# EAGLE design tx (EAGLE 7.2.0)
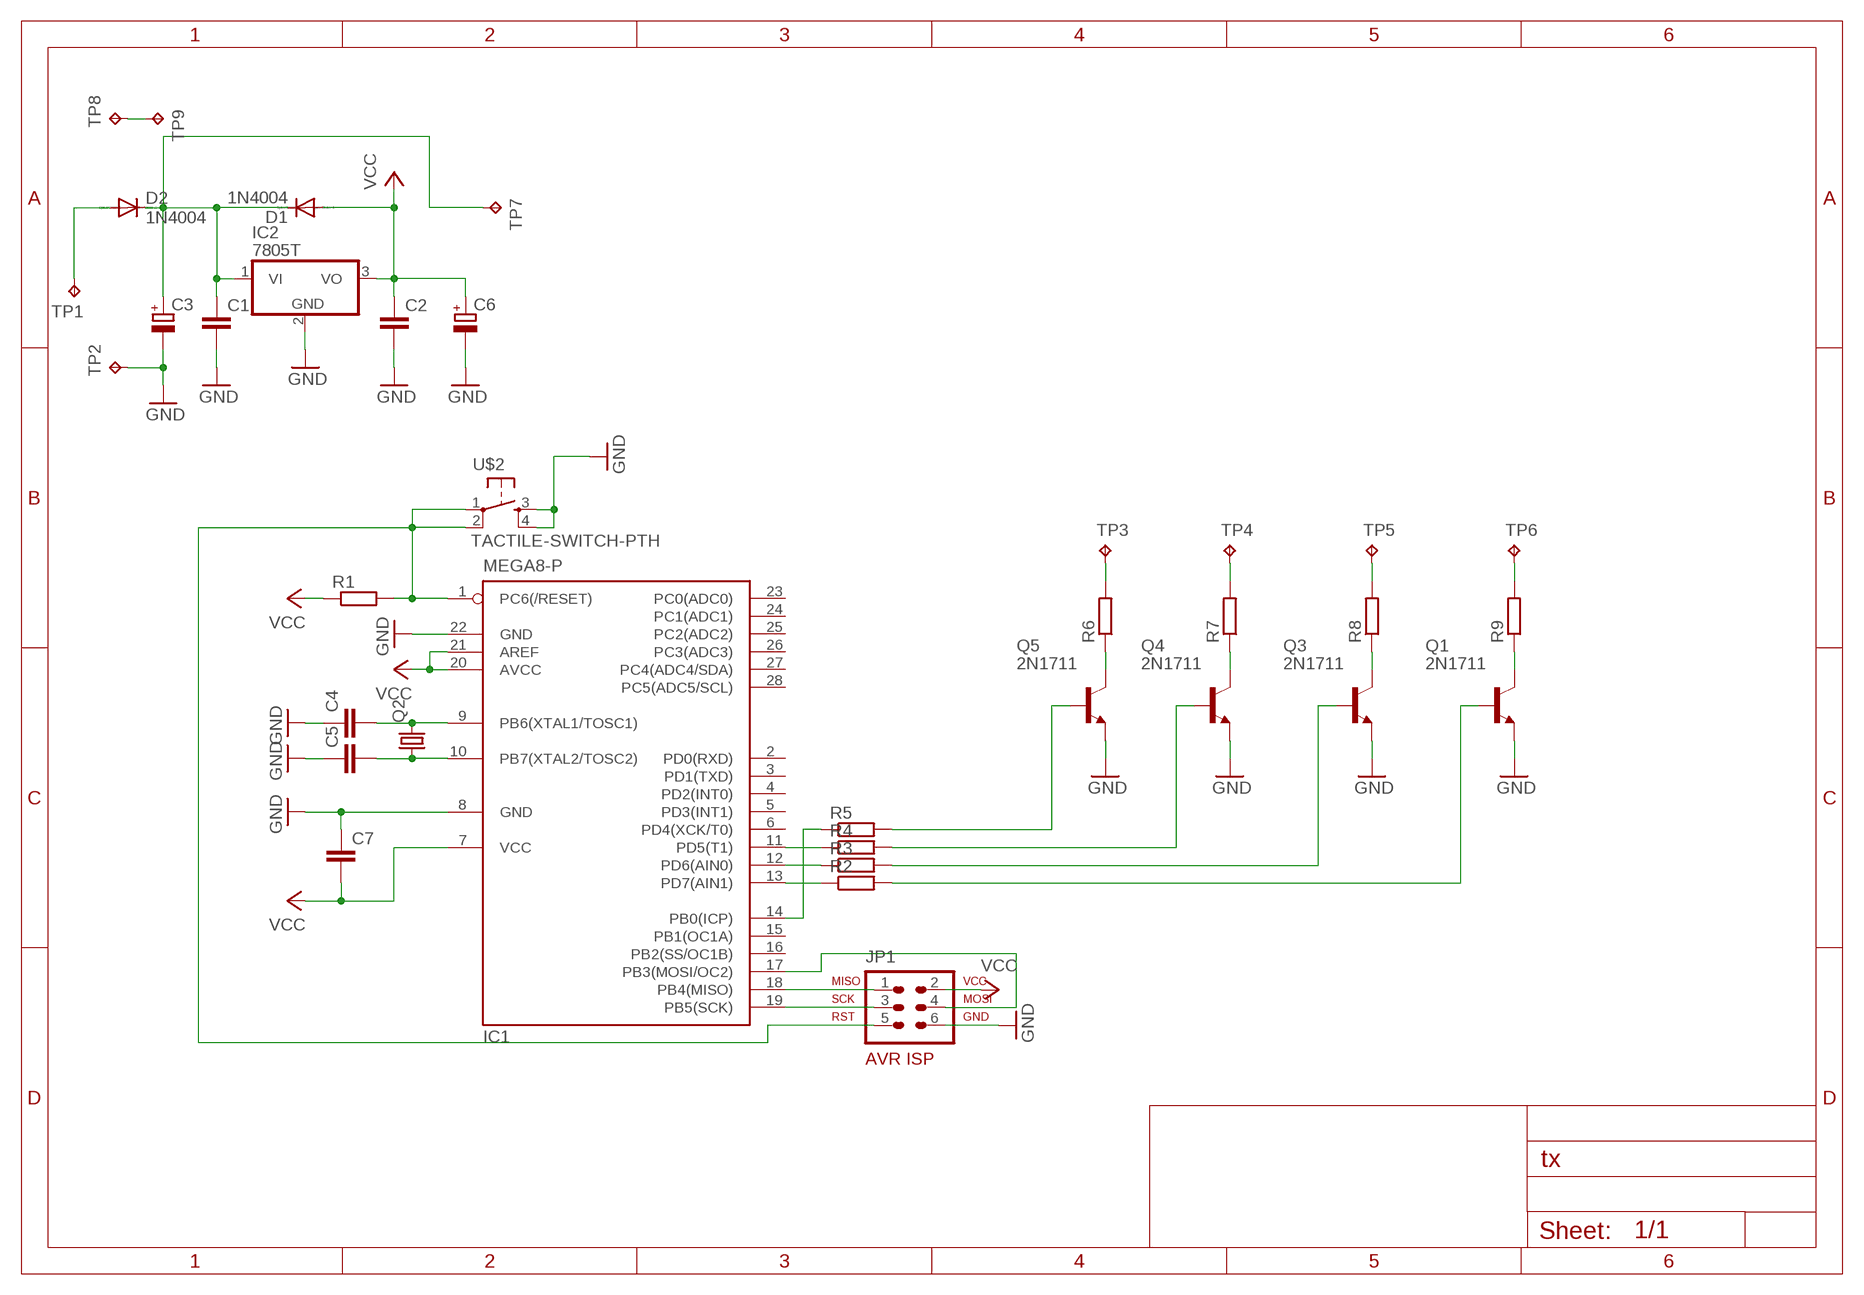
[diagram p0: schematic, sheet 1]

## Parts
C1  C-EU050-030X075  [C050-030X075]
C2  C-EU050-030X075  [C050-030X075]
C3  CPOL-EUE3.5-8  [E3,5-8]
C4  C-EU050-030X075  [C050-030X075]
C5  C-EU050-030X075  [C050-030X075]
C6  CPOL-EUE3.5-8  [E3,5-8]
C7  C-EU050-030X075  [C050-030X075]
D1  1N4004  [DO41-10]
D2  1N4004  [DO41-10]
IC1  MEGA8-P  [DIL28-3]
IC2  7805T  [TO220H]
JP1  AVR-ISP-6HORZ  [AVR-ISP-6R]
Q1  2N1711  [TO39]
Q2  CRYSTALHC49U70  [HC49U70]
Q3  2N1711  [TO39]
Q4  2N1711  [TO39]
Q5  2N1711  [TO39]
R1  R-EU_0204/7  [0204/7]
R2  R-EU_0204/7  [0204/7]
R3  R-EU_0204/7  [0204/7]
R4  R-EU_0204/7  [0204/7]
R5  R-EU_0204/7  [0204/7]
R6  R-EU_0204/7  [0204/7]
R7  R-EU_0204/7  [0204/7]
R8  R-EU_0204/7  [0204/7]
R9  R-EU_0204/7  [0204/7]
TP1  TPPAD1-13Y  [P1-13Y]
TP2  TPPAD1-13Y  [P1-13Y]
TP3  TPPAD1-13Y  [P1-13Y]
TP4  TPPAD1-13Y  [P1-13Y]
TP5  TPPAD1-13Y  [P1-13Y]
TP6  TPPAD1-13Y  [P1-13Y]
TP7  TPPAD1-13Y  [P1-13Y]
TP8  TPPAD1-13Y  [P1-13Y]
TP9  TPPAD1-13Y  [P1-13Y]
U$2  TACTILE-SWITCH-PTH  [TAC-SWITCH-PTH]

## Nets
GND: C1.2 C2.2 C3.- C4.1 C5.1 C6.- C7.1 IC1.8(GND) IC1.22(GND) IC2.2(GND) JP1.6 Q1.1(E) Q3.1(E) Q4.1(E) Q5.1(E) TP2.TP U$2.3 U$2.4
N$1: TP8.TP TP9.TP
N$2: C1.1 C3.+ D1.C D2.C IC2.1(VI) TP7.TP
N$3: IC1.1(PC6(/RESET)) JP1.5 R1.2 U$2.1 U$2.2
N$4: IC1.18(PB4(MISO)) JP1.1
N$5: IC1.19(PB5(SCK)) JP1.3
N$6: IC1.17(PB3(MOSI/OC2)) JP1.4
N$7: IC1.14(PB0(ICP)) R5.1
N$8: C4.2 IC1.9(PB6(XTAL1/TOSC1)) Q2.2
N$9: C5.2 IC1.10(PB7(XTAL2/TOSC2)) Q2.1
N$10: D2.A TP1.TP
N$11: IC1.11(PD5(T1)) R4.1
N$12: IC1.12(PD6(AIN0)) R3.1
N$13: IC1.13(PD7(AIN1)) R2.1
N$14: R6.2 TP3.TP
N$15: R7.2 TP4.TP
N$16: R8.2 TP5.TP
N$17: R9.2 TP6.TP
N$18: Q1.3(C) R9.1
N$19: Q3.3(C) R8.1
N$20: Q4.3(C) R7.1
N$21: Q5.3(C) R6.1
N$22: Q1.2(B) R2.2
N$23: Q3.2(B) R3.2
N$24: Q4.2(B) R4.2
N$25: Q5.2(B) R5.2
VCC: C2.1 C6.+ C7.2 D1.A IC1.7(VCC) IC1.20(AVCC) IC1.21(AREF) IC2.3(VO) JP1.2 R1.1
Unconnected: IC1.2(PD0(RXD)) IC1.3(PD1(TXD)) IC1.4(PD2(INT0)) IC1.5(PD3(INT1)) IC1.6(PD4(XCK/T0)) IC1.15(PB1(OC1A)) IC1.16(PB2(SS/OC1B)) IC1.23(PC0(ADC0)) IC1.24(PC1(ADC1)) IC1.25(PC2(ADC2)) IC1.26(PC3(ADC3)) IC1.27(PC4(ADC4/SDA)) IC1.28(PC5(ADC5/SCL))

## Library data of the parts
C1 C2 C4 C5 C7 = resistor:C-EU: CAPACITOR, European symbol
C3 C6 = resistor:CPOL-EU: POLARIZED CAPACITOR, European symbol
D1 D2 = diode:1N4004: DIODE general purpose rectifier, 1 A
IC1 = atmel:MEGA8-P: MICROCONTROLLER 8 Kbytes FLASH, 1 kbytes SRAM, 512 bytes EEPROM, USART, 4-channel 10 bit ADC, 2-channel 8 bit ADC Pin compatible with Atmega48, ATMega88, ATMega168 Source: avr.lbr; OC_FARNELL: unknown; OC_NEWARK: unknown
IC2 = linear:78*: Positive VOLTAGE REGULATOR Source: http://cache.national.com/ds/LM/LM78L05.pdf http://www.fairchildsemi.com/ds/LM/LM7805.pdf
JP1 = avr-7:AVR-ISP-6: AVR ISP-6 Serial Programming Header
Q1 Q3-Q5 = transistor-npn:2N1711: NPN Transistor
Q2 = crystal:CRYSTAL: CRYSTAL; OC_FARNELL: unknown; OC_NEWARK: unknown
R1-R9 = resistor:R-EU_: RESISTOR, European symbol
TP1-TP9 = testpad:TP: Test pad
U$2 = GeekAmmo:TACTILE-SWITCH: Tactile Switch 4 Pins, SPST NO

## Board
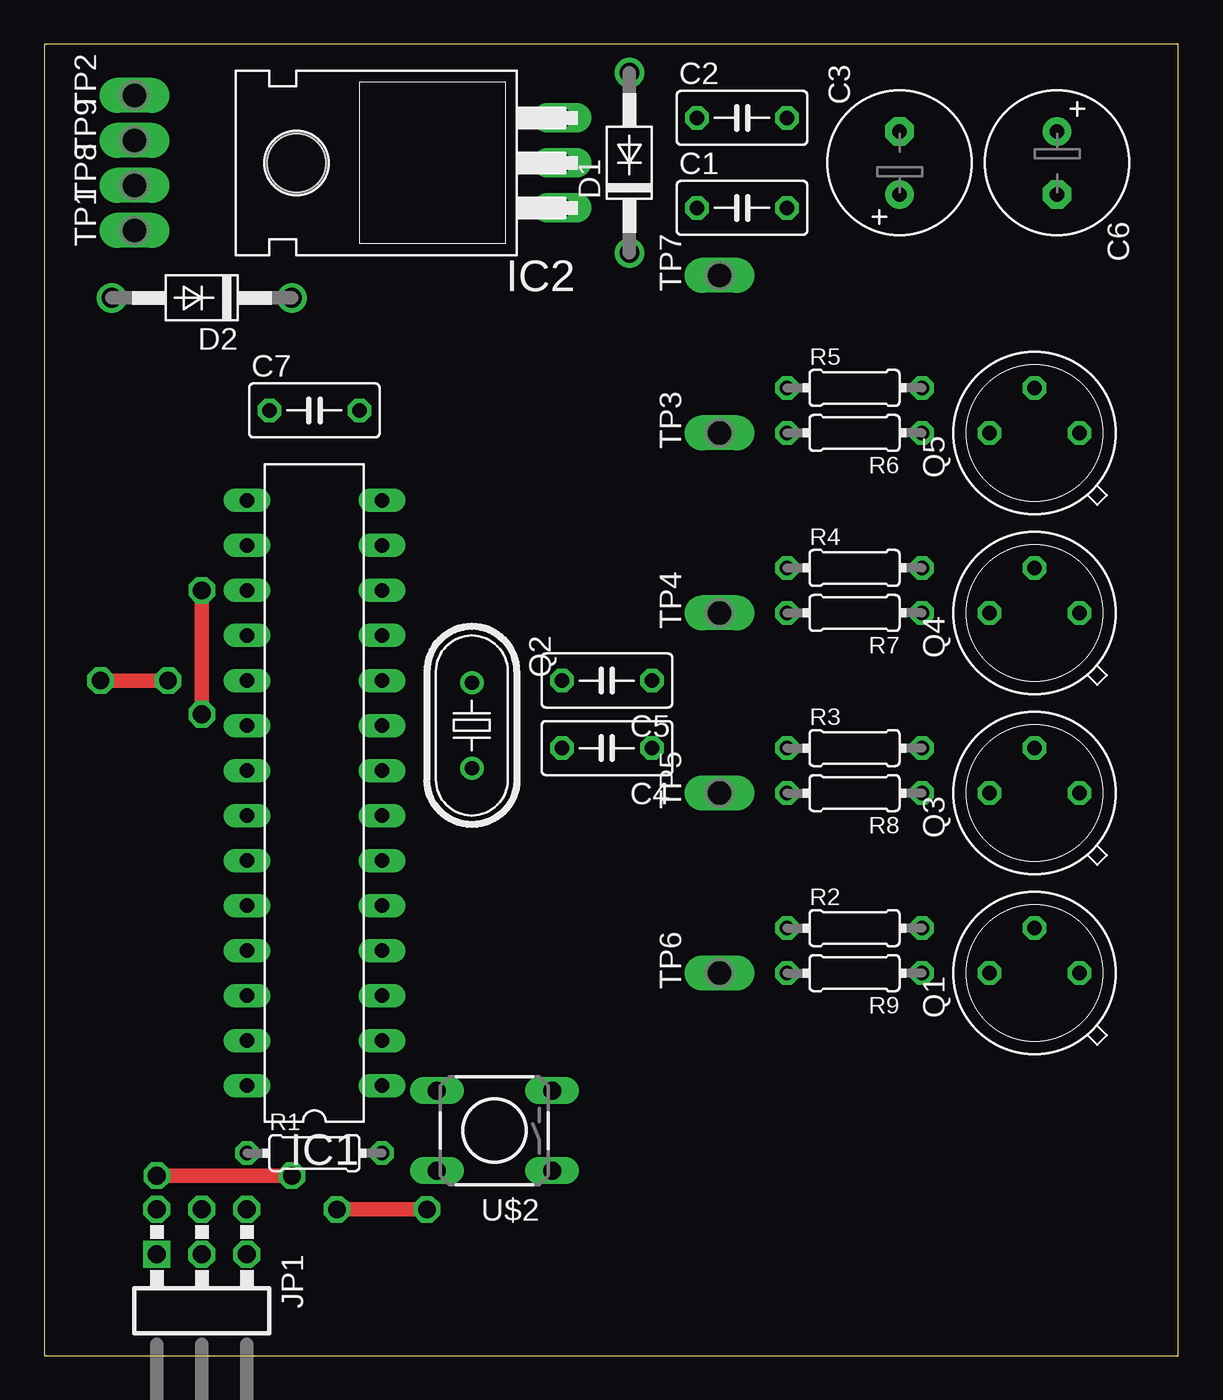
[diagram p1: board, top side]
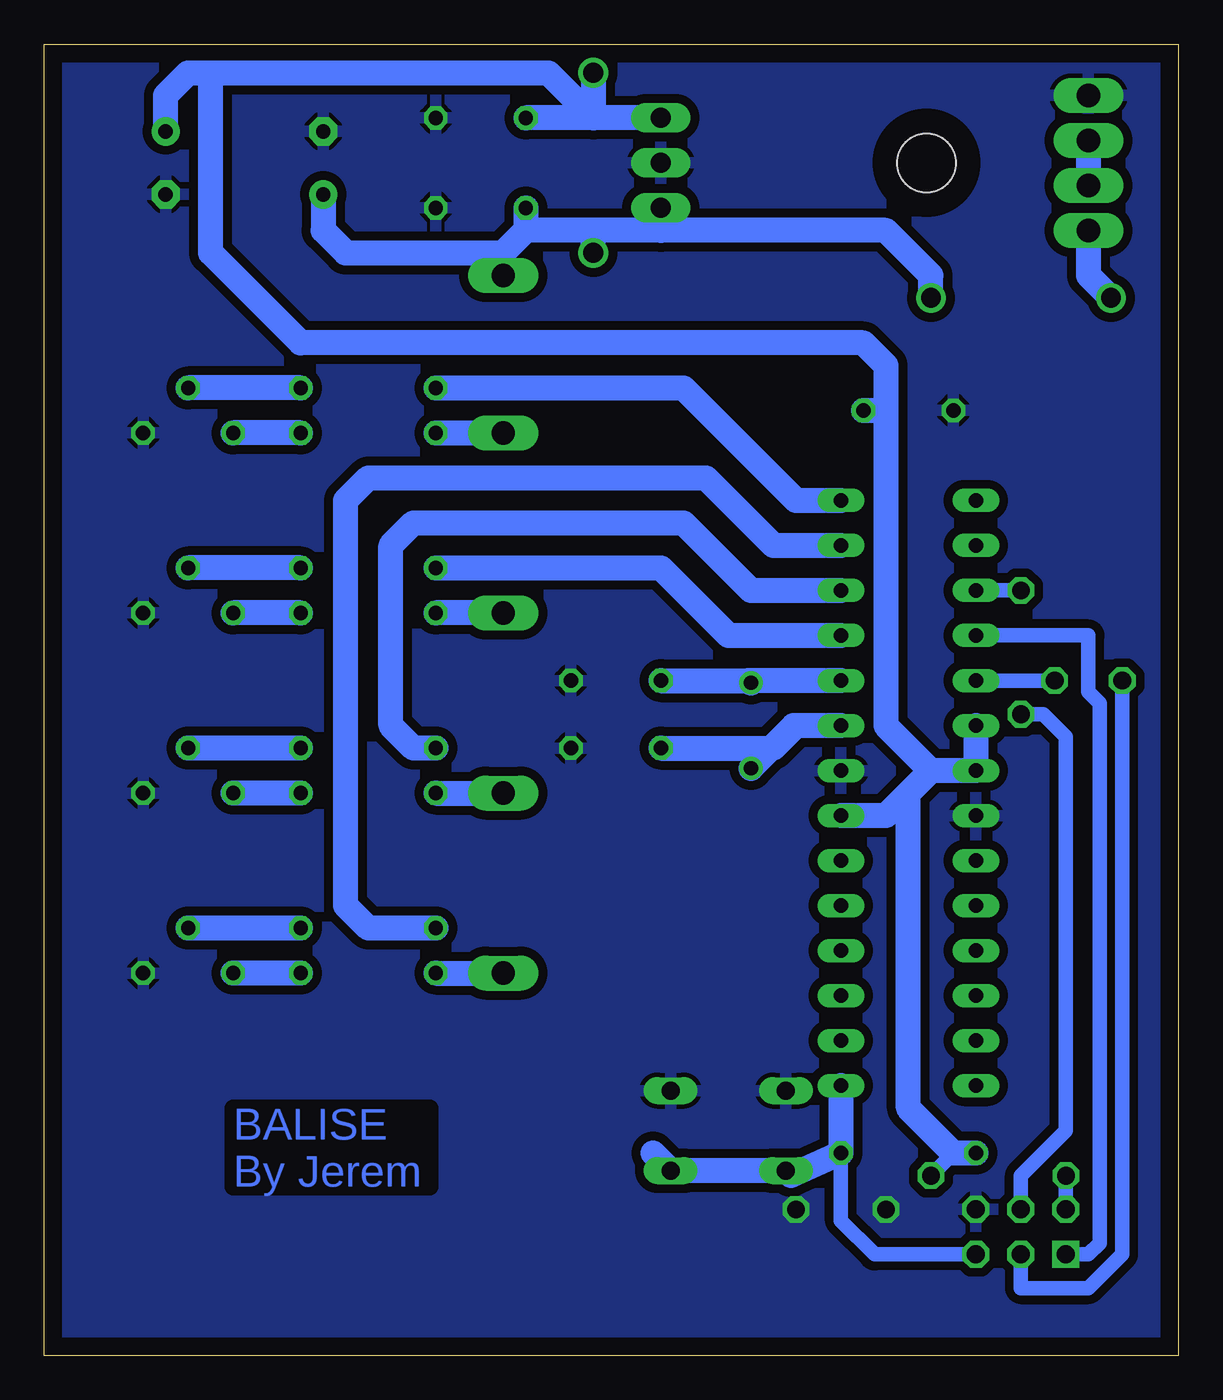
[diagram p2: board, bottom side, seen from below]

Size 64 x 74 mm. Coordinates in mm from the lower left corner, seen from the top.
Outline: 0,0 64,0 64,74 0,74 0,0
Copper layers (1*16): Top 0.035mm / dielectric 1.5mm / Bottom 0.035mm
Design rules "default": minimum track width 10mil, minimum drill 24mil, track to track 8mil, track to pad 8mil, pad to pad 8mil, via to via 8mil, smd to smd 8mil, copper to edge 40mil, drill to drill 8mil, minimum pad ring 10mil, minimum via ring 8mil, stop-mask expansion 4mil, vias tented up to drill 0mil, thermal gap 10mil

### Footprints (pad centres in the part's own frame; a part is rotated, then mirrored left to right if it is on the bottom)
C050-030X075 = drill 0.813 octagon: 1 -2.54,0; 2 2.54,0
E3,5-8 = drill 0.813 pad 1.6: + -1.778,0 | drill 0.813 pad 1.6 octagon: - 1.778,0
DO41-10 = drill 1.118: A 5.08,0; C -5.08,0
DIL28-3 = drill 0.813 long: 1 -16.51,-3.81; 2 -13.97,-3.81; 3 -11.43,-3.81; 4 -8.89,-3.81; 5 -6.35,-3.81; 6 -3.81,-3.81; 7 -1.27,-3.81; 8 1.27,-3.81; 9 3.81,-3.81; 10 6.35,-3.81; 11 8.89,-3.81; 12 11.43,-3.81; 13 13.97,-3.81; 14 16.51,-3.81; 15 16.51,3.81; 16 13.97,3.81; 17 11.43,3.81; 18 8.89,3.81; 19 6.35,3.81; 20 3.81,3.81; 21 1.27,3.81; 22 -1.27,3.81; 23 -3.81,3.81; 24 -6.35,3.81; 25 -8.89,3.81; 26 -11.43,3.81; 27 -13.97,3.81; 28 -16.51,3.81
TO220H = drill 1.118 long: 1 -2.54,-10.16; 2 0,-10.16; 3 2.54,-10.16 | hole 3.302: 0,4.826
AVR-ISP-6R = drill 1.016 square: 1 -2.54,-1.27 | drill 1.016 octagon: 2 -2.54,1.27; 3 0,-1.27; 4 0,1.27; 5 2.54,-1.27; 6 2.54,1.27
TO39 = drill 0.813 octagon: 1 0,-2.54; 2 2.54,0; 3 0,2.54
HC49U70 = drill 0.813: 1 -2.413,0; 2 2.413,0
0204/7 = drill 0.813 octagon: 1 -3.81,0; 2 3.81,0
P1-13Y = drill 1.321 pad 1.905 long: TP 0,0
TAC-SWITCH-PTH = drill 1.016 pad 1.524 long: 1 -3.251,2.261; 2 3.251,2.261; 3 -3.251,-2.261; 4 3.251,-2.261

### Placement (x,y rotation side)
C1  39.37,64.77 0 top
C2  39.37,69.85 0 top
C3  48.26,67.31 90 top
C4  31.75,34.29 180 top
C5  31.75,38.1 180 top
C6  57.15,67.31 270 top
C7  15.24,53.34 0 top
D1  33.02,67.31 90 top
D2  8.89,59.69 180 top
IC1  15.24,31.75 90 top
IC2  19.05,67.31 90 top
JP1  8.89,6.99 0 top
Q1  55.88,21.59 90 top
Q2  24.13,35.56 270 top
Q3  55.88,31.75 90 top
Q4  55.88,41.91 90 top
Q5  55.88,52.07 90 top
R1  15.24,11.43 0 top
R2  45.72,24.13 0 top
R3  45.72,34.29 0 top
R4  45.72,44.45 0 top
R5  45.72,54.61 0 top
R6  45.72,52.07 180 top
R7  45.72,41.91 180 top
R8  45.72,31.75 180 top
R9  45.72,21.59 180 top
TP1  5.08,63.5 90 top
TP2  5.08,71.12 90 top
TP3  38.1,52.07 90 top
TP4  38.1,41.91 90 top
TP5  38.1,31.75 90 top
TP6  38.1,21.59 90 top
TP7  38.1,60.96 90 top
TP8  5.08,66.04 90 top
TP9  5.08,68.58 90 top
U$2  25.4,12.7 180 top

### Tracks (layer width: path | path; a pad name or v marks a point on that pad's centre or on a via)
GND  (via drill 1)
  Top 0.813: v16.51,8.26 v21.59,8.26
  pour Bottom (isolate 0.5): 0,0 64,0 64,74 0,74
N$1
  Bottom 1.422: TP9.TP TP8.TP
N$2
  Bottom 1.422: D2.C 13.97,60.96 16.51,63.5 29.21,63.5 | 29.21,63.5 33.02,63.5 | 33.02,63.5 36.83,63.5 | 36.83,63.5 38.1,62.23 | 38.1,62.23 TP7.TP | IC2.1 29.21,63.5 | D1.C 33.02,63.5 | C1.1 36.83,63.5 | C3.+ 48.26,63.5 46.99,62.23 38.1,62.23
N$3
  Bottom 0.813: JP1.5 17.14,5.71 19.05,7.62 R1.2
  Bottom 1.422: IC1.1 R1.2 21.87,10.16 U$2.2 U$2.1 29.64,11.43
N$4
  Bottom 0.813: JP1.1 5.08,5.71 4.45,6.35 4.45,36.83 5.08,37.47 5.08,40.64 IC1.18
N$5  (via drill 1)
  Top 0.813: v3.17,38.1 v6.99,38.1
  Bottom 0.813: JP1.3 8.89,3.81 5.08,3.81 3.17,5.71 v3.17,38.1 | v6.99,38.1 IC1.19
N$6  (via drill 1)
  Top 0.813: v8.89,36.2 v8.89,43.18
  Bottom 0.813: v8.89,43.18 IC1.17 | JP1.4 8.89,10.16 6.35,12.7 6.35,34.92 7.62,36.2 v8.89,36.2
N$7
  Bottom 1.422: R5.1 27.94,54.61 21.59,48.26 IC1.14
N$8
  Bottom 1.422: IC1.9 21.59,35.56 | 21.59,35.56 21.72,35.56 Q2.2 | C4.2 22.86,34.29 21.59,35.56
N$9
  Bottom 1.422: C5.2 24.26,38.1 Q2.1 24,38.1 IC1.10
N$10
  Bottom 1.422: TP1.TP 5.08,60.96 D2.A
N$11
  Bottom 1.422: R4.1 29.21,44.45 25.4,40.64 IC1.11
N$12
  Bottom 1.422: R3.1 43.18,34.29 44.45,35.56 44.45,45.72 43.18,46.99 27.94,46.99 24.13,43.18 IC1.12
N$13
  Bottom 1.422: R2.1 45.72,24.13 46.99,25.4 46.99,48.26 45.72,49.53 26.67,49.53 22.86,45.72 IC1.13
N$14
  Bottom 1.422: R6.2 TP3.TP
N$15
  Bottom 1.422: TP4.TP R7.2
N$16
  Bottom 1.422: R8.2 TP5.TP
N$17
  Bottom 1.422: R9.2 TP6.TP
N$18
  Bottom 1.422: R9.1 Q1.3
N$19
  Bottom 1.422: R8.1 Q3.3
N$20
  Bottom 1.422: R7.1 Q4.3
N$21
  Bottom 1.422: R6.1 Q5.3
N$22
  Bottom 1.422: R2.2 Q1.2
N$23
  Bottom 1.422: R3.2 Q3.2
N$24
  Bottom 1.422: R4.2 Q4.2
N$25
  Bottom 1.422: R5.2 Q5.2
VCC  (via drill 1)
  Top 0.813: v6.35,10.16 v13.97,10.16
  Bottom 0.813: JP1.2 v6.35,10.16 | v13.97,10.16 12.7,11.43
  Bottom 1.422: IC2.3 33.02,69.85 | 33.02,69.85 C2.1 | D1.A 33.02,69.85 | C6.+ 57.15,71.12 55.88,72.39 54.61,72.39 | 54.61,72.39 35.56,72.39 33.02,69.85 | 13.97,33.02 IC1.21 IC1.20 | 13.97,33.02 15.24,31.75 | 15.24,31.75 16.51,30.48 IC1.7 | 54.61,72.39 54.61,62.23 49.53,57.15 17.78,57.15 16.51,55.88 16.51,53.34 | 16.51,53.34 16.51,35.56 13.97,33.02 | C7.2 16.51,53.34 | R1.1 12.7,11.43 15.24,13.97 15.24,31.75

### Text on the board
Bottom: BALISE / By Jerem